# Altium schematic sheet Dental Sensor.SchDoc
size A4; Date: 26-09-2022; Engineer: Christian Peppelman; Revision: V110; SheetNumber: 1; SheetTotal: 1; ProjectSheetName: Dental Sensor Hardware Demonstrator; SheetName: Regular Version
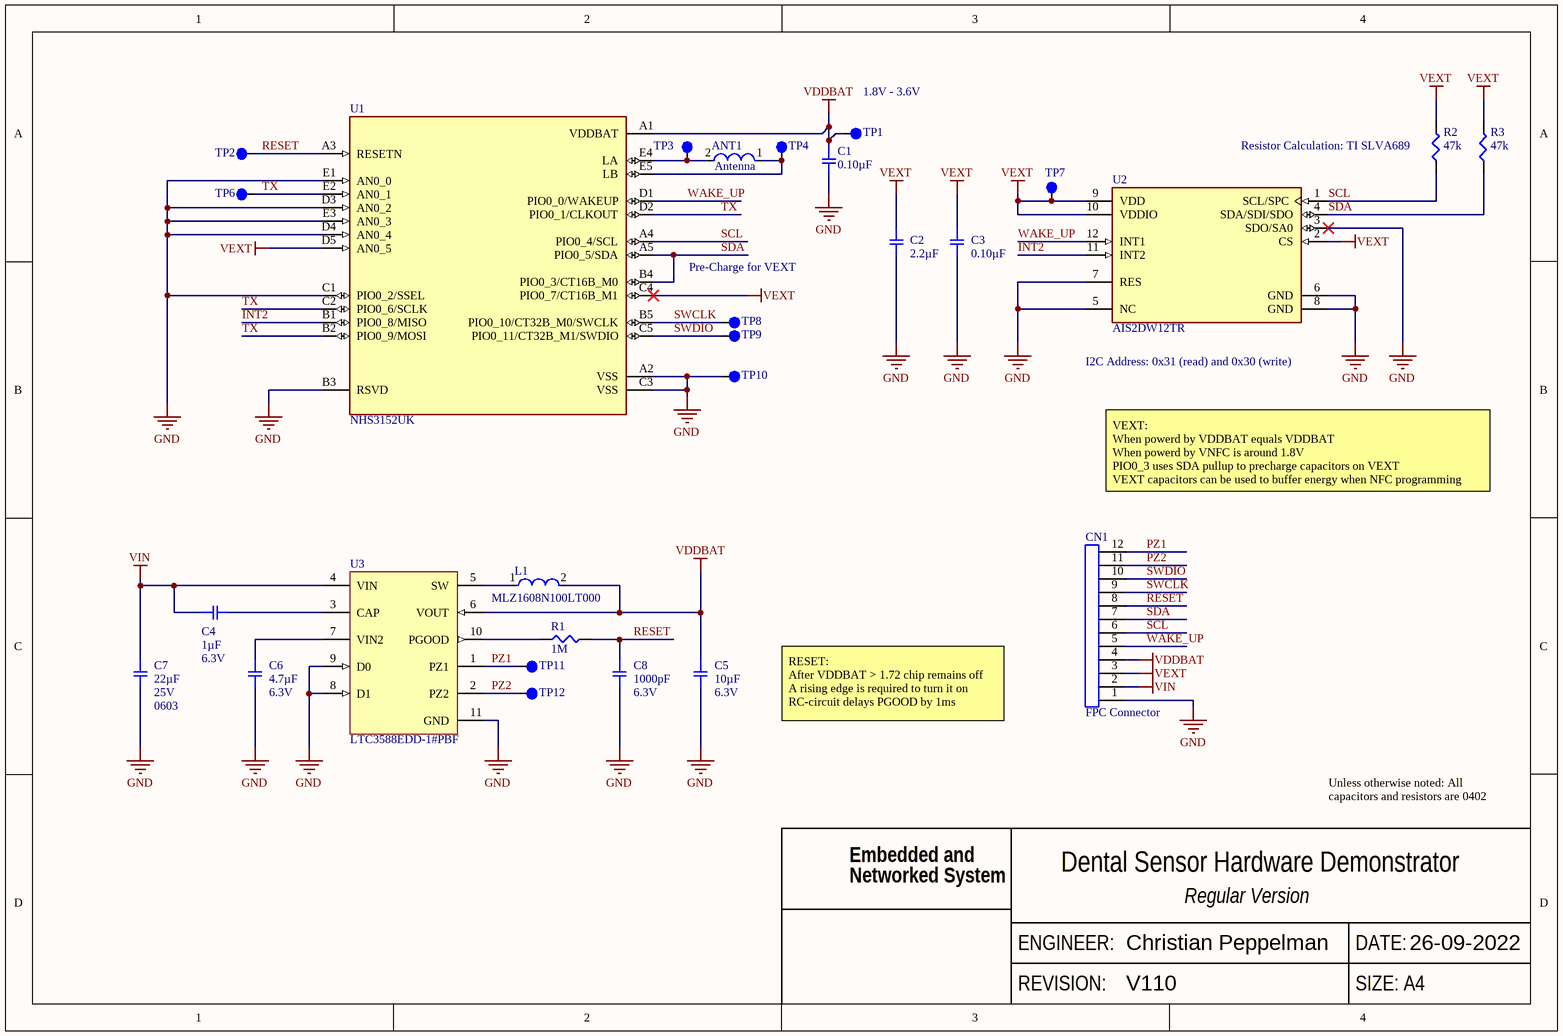
[diagram p0: Dental Sensor.SchDoc]

## Parts
ANT1  Antenna  [NFC Antenna]  (net tie, no BOM)
C1  0.10µF  [CAPC1005X03N]
C2  2.2µF  [CAPC1005X03N]
C3  0.10µF  [CAPC1005X03N]
C4  1µF  Voltage: 6.3V  [CAPC1005X03N]
C5  10µF  Voltage: 6.3V  [CAPC1005X03N]
C6  4.7µF  Voltage: 6.3V  [CAPC1005X03N]
C7  22µF  Voltage: 25V  Package / Case: 0603  [CAPC1608X12N]
C8  1000pF  Voltage: 6.3V  [CAPC1005X03N]
CN1  FPC Connector  [52745-1297]
L1  MLZ1608N100LT000  [FP-MLZ1608-MFG]
R1  1M  [RESC1005X03N]
R2  47k  [RESC1005X03N]
R3  47k  [RESC1005X03N]
TP1  Testpoint  [Testpoint 0.35mm]  (value not drawn)
TP2  Testpoint  [Testpoint 0.35mm]  (value not drawn)
TP3  Testpoint  [Testpoint 0.35mm]  (value not drawn)
TP4  Testpoint  [Testpoint 0.35mm]  (value not drawn)
TP6  Testpoint  [Testpoint 0.35mm]  (value not drawn)
TP7  Testpoint  [Testpoint 0.35mm]  (value not drawn)
TP8  Testpoint  [Testpoint 0.35mm]  (value not drawn)
TP9  Testpoint  [Testpoint 0.35mm]  (value not drawn)
TP10  Testpoint  [Testpoint 0.35mm]  (value not drawn)
TP11  Testpoint  [Testpoint 0.35mm]  (value not drawn)
TP12  Testpoint  [Testpoint 0.35mm]  (value not drawn)
U1  NHS3152UK  [WLCSP25]
U2  AIS2DW12TR  [FP-LGA12-DM00369449-MFG]
U3  LTC3588EDD-1#PBF  [LT-DD-10_V]

## Nets
GND: C1.2 C2.2 C3.2 C5.2 C6.2 C7.2 C8.2 CN1.1 TP10.1 U1.A2(VSS) U1.B3(RSVD) U1.C1(PIO0_2/SSEL) U1.C3(VSS) U1.D3(AN0_2) U1.D4(AN0_4) U1.E1(AN0_0) U1.E3(AN0_3) U2.3(SDO/SA0) U2.5(NC) U2.6(GND) U2.7(RES) U2.8(GND) U3.8(D1) U3.9(D0) U3.11(GND)
VDDBAT: C1.1 C5.1 CN1.4 L1.2 TP1.1 U1.A1(VDDBAT) U3.6(VOUT)
VEXT: C2.1 C3.1 CN1.3 R2.2 R3.2 TP7.1 U1.C4(PIO0_7/CT16B_M1) U1.D5(AN0_5) U2.2(CS) U2.9(VDD) U2.10(VDDIO)
VIN: C4.1 C7.1 CN1.2 U3.4(VIN)
INT2: U1.B1(PIO0_8/MISO) U2.11(INT2)
PZ1: CN1.12 TP11.1 U3.1(PZ1)
PZ2: CN1.11 TP12.1 U3.2(PZ2)
RESET: C8.1 CN1.8 R1.2 TP2.1 U1.A3(RESETN)
SCL: CN1.6 R2.1 U1.A4(PIO0_4/SCL) U2.1(SCL/SPC)
SDA: CN1.7 R3.1 U1.A5(PIO0_5/SDA) U1.B4(PIO0_3/CT16B_M0) U2.4(SDA/SDI/SDO)
SWCLK: CN1.9 TP8.1 U1.B5(PIO0_10/CT32B_M0/SWCLK)
SWDIO: CN1.10 TP9.1 U1.C5(PIO0_11/CT32B_M1/SWDIO)
TX: TP6.1 U1.B2(PIO0_9/MOSI) U1.C2(PIO0_6/SCLK) U1.D2(PIO0_1/CLKOUT) U1.E2(AN0_1)
WAKE_UP: CN1.5 U1.D1(PIO0_0/WAKEUP) U2.12(INT1)
NetANT1_1: ANT1.1 TP4.1 U1.E5(LB)
NetANT1_2: ANT1.2 TP3.1 U1.E4(LA)
NetC4_2: C4.2 U3.3(CAP)
NetC6_1: C6.1 U3.7(VIN2)
NetL1_1: L1.1 U3.5(SW)
NetR1_1: R1.1 U3.10(PGOOD)

## Notes on the sheet
- (near TP1) 1.8V - 3.6V
- (near R2) Resistor Calculation: TI SLVA689
- Pre-Charge for VEXT
- (near U2) I2C Address: 0x31 (read) and 0x30 (write)
- VEXT:
  When powerd by VDDBAT equals VDDBAT
  When powerd by VNFC is around 1.8V
  PIO0_3 uses SDA pullup to precharge capacitors on VEXT
  VEXT capacitors can be used to buffer energy when NFC programming
- RESET:
  After VDDBAT > 1.72 chip remains off
  A rising edge is required to turn it on
  RC-circuit delays PGOOD by 1ms
- Unless otherwise noted: All capacitors and resistors are 0402
- Embedded and
- Networked System
- ENGINEER:
- DATE:
- REVISION:
- SIZE: A4

## Library data of the parts
ANT1 = NFC Antenna: Track 0.2; Gap 0.1; Height 4.6; Width 14.5;
C1 C3 = GRM155R60J104KA01D: CAP CER 0.1UF 6.3V X5R 0402; Manufacturer: Murata Electronics North America; Factory Stock: 0; Unit Price (USD): 0.1; Minimum Quantity: 1; Tolerance: ±10%; Datasheets: http://www.murata.com/~/media/webrenewal/support/library/catalog/products/capacitor/mlcc/c02e.pdf; Image: //media.digikey.com/Renders/Murata%20Renders/ZRB-SERIES-0402.jpg; Digi-Key Part Number: 490-6287-1-ND; Part Number: GRM155R60J104KA01D; Quantity Available: 356062; @ qty: 0; Packaging: Cut Tape (CT); Series: GRM; Part Status: Active; Value: 0.10µF; Voltage: 6.3V; Temperature Coefficient: X5R; Operating Temperature: -55°C ~ 85°C; Features: -; Ratings: -; Applications: General Purpose; Mounting Type: Surface Mount, MLCC; Package / Case: 0402 (1005 Metric); Size / Dimension: 0.039" L x 0.020" W (1.00mm x 0.50mm); Height - Seated (Max): -; Thickness (Max): 0.022" (0.55mm); Lead Spacing: -
C2 = GRT155R60J225KE01D: CAP CER 2.2UF 6.3V X5R 0402; Manufacturer: Murata Electronics North America; Factory Stock: 0; Unit Price (USD): 0.12; Minimum Quantity: 1; Tolerance: ±10%; Datasheets: http://search.murata.co.jp/Ceramy/image/img/A01X/G101/ENG/GRT155R60J225KE01-01.pdf; Image: //media.digikey.com/Renders/Murata%20Renders/ZRB-SERIES-0402.jpg; Digi-Key Part Number: 490-12250-1-ND; Part Number: GRT155R60J225KE01D; Quantity Available: 39775; @ qty: 0; Packaging: Cut Tape (CT); Series: GRT; Part Status: Active; Value: 2.2µF; Voltage: 6.3V; Temperature Coefficient: X5R; Operating Temperature: -55°C ~ 85°C; Features: -; Ratings: AEC-Q200; Applications: Automotive; Mounting Type: Surface Mount, MLCC; Package / Case: 0402 (1005 Metric); Size / Dimension: 0.039" L x 0.020" W (1.00mm x 0.50mm); Height - Seated (Max): -; Thickness (Max): 0.022" (0.55mm); Lead Spacing: -; Lead Style: -
C4 = GRM155R70J105MA12D: CAP CER 1UF 6.3V X7R 0402; Manufacturer: Murata Electronics North America; Factory Stock: 0; Unit Price (USD): 0.1; Minimum Quantity: 1; Tolerance: ±20%; Datasheets: http://www.murata.com/~/media/webrenewal/support/library/catalog/products/capacitor/mlcc/c02e.pdf; Image: //media.digikey.com/Renders/Murata%20Renders/ZRB-SERIES-0402.jpg; Digi-Key Part Number: 490-9665-1-ND; Part Number: GRM155R70J105MA12D; Quantity Available: 38208; @ qty: 0; Packaging: Cut Tape (CT); Series: GRM; Part Status: Active; Value: 1µF; Temperature Coefficient: X7R; Operating Temperature: -55°C ~ 125°C; Features: Derating Recommended; Ratings: -; Applications: General Purpose; Mounting Type: Surface Mount, MLCC; Package / Case: 0402 (1005 Metric); Size / Dimension: 0.039" L x 0.020" W (1.00mm x 0.50mm); Height - Seated (Max): -; Thickness (Max): 0.022" (0.55mm); Lead Spacing: -; Lead Style: -
C5 = GRM155R60J106ME44D: CAP CER 10UF 6.3V X5R 0402; Manufacturer: Murata Electronics North America; Factory Stock: 0; Unit Price (USD): 0.23; Minimum Quantity: 1; Tolerance: ±20%; Datasheets: http://www.murata.com/~/media/webrenewal/support/library/catalog/products/capacitor/mlcc/c02e.pdf; Image: //media.digikey.com/Renders/Murata%20Renders/ZRB-SERIES-0402.jpg; Digi-Key Part Number: 490-13811-1-ND; Part Number: GRM155R60J106ME44D; Quantity Available: 191464; @ qty: 0; Packaging: Cut Tape (CT); Series: GRM; Part Status: Active; Value: 10µF; Temperature Coefficient: X5R; Operating Temperature: -55°C ~ 85°C; Features: -; Ratings: -; Applications: General Purpose; Mounting Type: Surface Mount, MLCC; Package / Case: 0402 (1005 Metric); Size / Dimension: 0.039" L x 0.020" W (1.00mm x 0.50mm); Height - Seated (Max): -; Thickness (Max): 0.022" (0.55mm); Lead Spacing: -; Lead Style: -
C6 = ZRB15XR60J475ME01D: CAP CER 4.7UF 6.3V X5R 0402; Manufacturer: Murata Electronics North America; Factory Stock: 0; Unit Price (USD): 0.36; Minimum Quantity: 1; Tolerance: ±20%; Datasheets: http://search.murata.co.jp/Ceramy/image/img/A01X/G101/ENG/ZRB15XR60J475ME01-01.pdf; Image: //media.digikey.com/Renders/Murata%20Renders/ZRB-SERIES-0402.jpg; Digi-Key Part Number: 490-10983-1-ND; Part Number: ZRB15XR60J475ME01D; Quantity Available: 10846; @ qty: 0; Packaging: Cut Tape (CT); Series: ZRB; Part Status: Active; Value: 4.7µF; Temperature Coefficient: X5R; Operating Temperature: -55°C ~ 85°C; Features: Interposer Termination; Ratings: -; Applications: Acoustic Noise Reduction; Mounting Type: Surface Mount, MLCC; Package / Case: 0402 (1005 Metric); Size / Dimension: 0.039" L x 0.020" W (1.00mm x 0.50mm); Height - Seated (Max): -; Thickness (Max): 0.031" (0.80mm); Lead Spacing: -; Lead Style: -
C7 = GRM187R61A226ME15D: CAP CER 22UF 10V X5R 0603; Manufacturer: Murata Electronics North America; Factory Stock: 0; Unit Price (USD): 0.54; Minimum Quantity: 1; Tolerance: ±20%; Datasheets: http://psearch.en.murata.com/capacitor/product/GRM187R61A226ME15%23.pdf; Image: //media.digikey.com/Renders/Murata%20Renders/ZRB-SERIES-0402.jpg; Digi-Key Part Number: 490-13243-1-ND; Part Number: GRM187R61A226ME15D; Quantity Available: 10253; @ qty: 0; Packaging: Cut Tape (CT); Series: GRM; Part Status: Active; Value: 22µF; Temperature Coefficient: X5R; Operating Temperature: -55°C ~ 85°C; Features: Derating Recommended; Ratings: -; Applications: General Purpose; Mounting Type: Surface Mount, MLCC; Size / Dimension: 0.063" L x 0.031" W (1.60mm x 0.80mm); Height - Seated (Max): -; Thickness (Max): 0.031" (0.80mm); Lead Spacing: -; Lead Style: -
C8 = GRM155R60J102KA01D: CAP CER 1000PF 6.3V X5R 0402; Manufacturer: Murata Electronics North America; Factory Stock: 0; Unit Price (USD): 0.1; Minimum Quantity: 1; Tolerance: ±10%; Datasheets: http://www.murata.com/~/media/webrenewal/support/library/catalog/products/capacitor/mlcc/c02e.pdf; Image: //media.digikey.com/Renders/Murata%20Renders/ZRB-SERIES-0402.jpg; Digi-Key Part Number: 490-6285-1-ND; Part Number: GRM155R60J102KA01D; Quantity Available: 65829; @ qty: 0; Packaging: Cut Tape (CT); Series: GRM; Part Status: Active; Value: 1000pF; Temperature Coefficient: X5R; Operating Temperature: -55°C ~ 85°C; Features: -; Ratings: -; Applications: General Purpose; Mounting Type: Surface Mount, MLCC; Package / Case: 0402 (1005 Metric); Size / Dimension: 0.039" L x 0.020" W (1.00mm x 0.50mm); Height - Seated (Max): -; Thickness (Max): 0.022" (0.55mm); Lead Spacing: -
CN1 = 52745-1297: FFC / FPC Board Connector, 0.5 mm, 12 Contacts, Receptacle, Easy-On 52745, Surface Mount, Top
L1 = CMP-08253-000255-1: Shielded Multilayer Inductor 10uH ±20% 300mA 780mΩ SMD 0603; Self Resonant Frequency: 50MHz; Core Material: Ferrite; Saturation Current: 60mA; Test Frequency: 2MHz; DC Resistance (DCR): 780mR; Lead Free: Lead Free; Case Code (Metric): 1608; Min Operating Temperature: -55°C; Length: 0.063inch; Max Operating Temperature: 125°C; RoHS Compliant: Yes; Case/Package: 0603; Mount: Surface Mount; Tolerance: 20%; Packaging: Tape and Reel; Height - Seated (Max): 0.037inch; Shielding: Shielded; Case Code (Imperial): 0603; Current Rating: 300mA; Package Quantity: 4000; Width: 0.031inch; Inductance: 10uH
R1 = ERJ-2RKF1004X: RES SMD 1M OHM 1% 1/10W 0402; Manufacturer: Panasonic Electronic Components; Factory Stock: 0; Unit Price (USD): 0.00496; @ qty: 1500; Minimum Quantity: 1; Power (Watts): 0.1W, 1/10W; Temperature Coefficient: ±100ppm/°C; Part Number: ERJ-2RKF1004X; Datasheets: http://industrial.panasonic.com/www-cgi/jvcr13pz.cgi?E+PZ+3+AOA0002+ERJ2RKF1004X+7+WW; Image: //media.digikey.com/Photos/Panasonic%20Photos/ERJ-PA2-Series.jpg; Digi-Key Part Number: P1.00MLCT-ND; Quantity Available: 773705; Packaging: Cut Tape (CT); Series: ERJ; Part Status: Active; Value: 1M; Tolerance: ±1%; Composition: Thick Film; Features: Automotive AEC-Q200; Operating Temperature: -55°C ~ 155°C; Package / Case: 0402 (1005 Metric); Supplier Device Package: 0402; Size / Dimension: 0.039" L x 0.020" W (1.00mm x 0.50mm); Height - Seated (Max): 0.016" (0.40mm); Number of Terminations: 2; Failure Rate: -
R2 R3 = ERJ-2RKF4702X: RES SMD 47K OHM 1% 1/10W 0402; Manufacturer: Panasonic Electronic Components; Factory Stock: 0; Unit Price (USD): 0.00496; @ qty: 1500; Minimum Quantity: 1; Power (Watts): 0.1W, 1/10W; Temperature Coefficient: ±100ppm/°C; Part Number: ERJ-2RKF4702X; Datasheets: http://industrial.panasonic.com/www-cgi/jvcr13pz.cgi?E+PZ+3+AOA0002+ERJ2RKF4702X+7+WW; Image: //media.digikey.com/Photos/Panasonic%20Photos/ERJ-PA2-Series.jpg; Digi-Key Part Number: P47.0KLCT-ND; Quantity Available: 230515; Packaging: Cut Tape (CT); Series: ERJ; Part Status: Active; Value: 47k; Tolerance: ±1%; Composition: Thick Film; Features: Automotive AEC-Q200; Operating Temperature: -55°C ~ 155°C; Package / Case: 0402 (1005 Metric); Supplier Device Package: 0402; Size / Dimension: 0.039" L x 0.020" W (1.00mm x 0.50mm); Height - Seated (Max): 0.016" (0.40mm); Number of Terminations: 2; Failure Rate: -
U1 = NHS3152UK: ARM-microcontrollers - MCU NTAG NHS3152 NFC
U2 = CMP-12175-000014-1: MEMS DIGITAL OUTPUT MOTION SENSO; RoHS Compliant: Yes
U3 = CMP-0473-00034-1: Piezoelectric Energy Harvesting Power Supply, 10-pin SON (DD-10), -40 to 125 degC, Pb-Free; Manufacturer: Linear Technology; Number of Outputs: 1; Vin Max(V): 20; Vout Max(V): 1.8, 2.5, 3.3, 3.6; Vin Min(V): 2.7; Topology: Buck; ComponentLink2URL: http://cds.linear.com/docs/en/datasheet/35881fa.pdf; PartNumber: LTC3588EDD-1#PBF; ComponentLink1URL: http://www.linear.com/; PackageReference: DD-10; ComponentLink3URL: http://cds.linear.com/docs/en/packaging/DFN_10_05-08-1699.pdf; ComponentLink1Description: Manufacturer URL; ComponentLink3Description: Package Specification; ComponentLink2Description: Datasheet; RoHS: TRUE; Code_JEDEC: MO-229; Mounting Technology: Surface Mount; PackageVersion: Rev. C, 06/2010; PackageDescription: 10-Pin Plastic DFN, Body 3 x 3 mm, Pitch 0.5 mm; DatasheetVersion: Rev. A; Energy Source: Piezoelectric